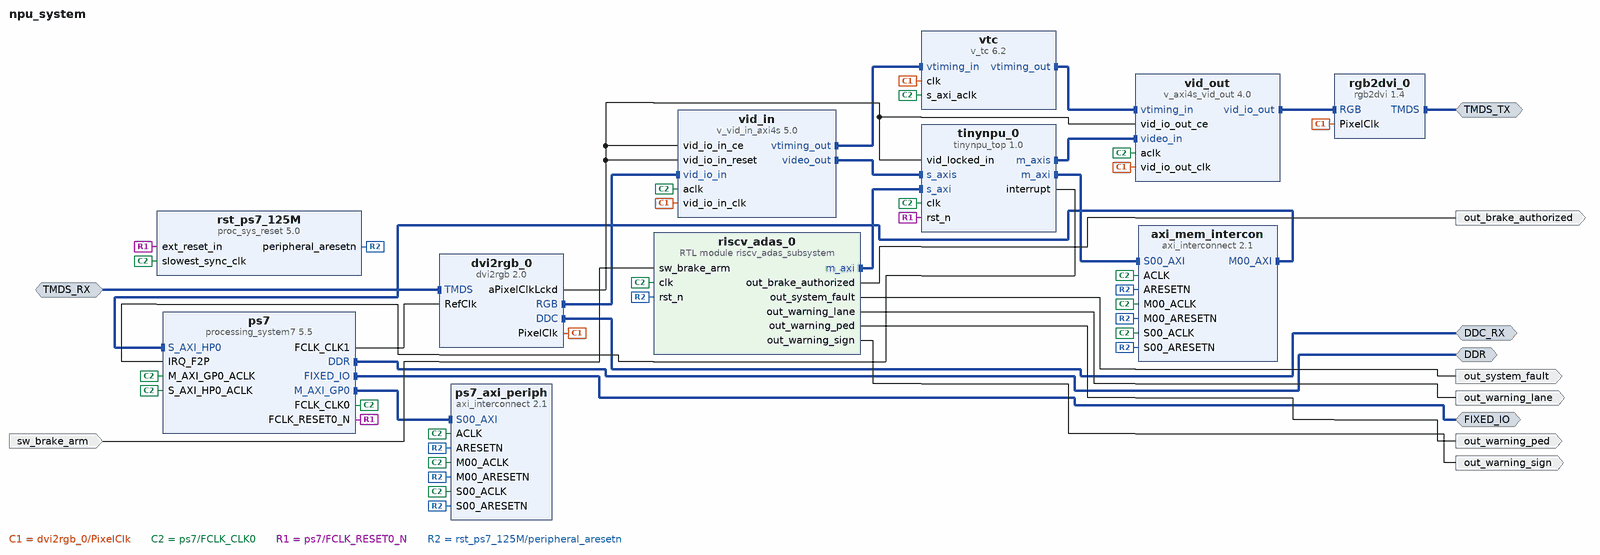
[diagram p0: block diagram of the top level]
# Vivado block design npu_system, xc7z020clg400-1, Vivado 2025.1
create_bd_design npu_system

create_bd_intf_port -mode Master -vlnv xilinx.com:interface:ddrx_rtl:1.0 DDR
create_bd_intf_port -mode Master -vlnv xilinx.com:display_processing_system7:fixedio_rtl:1.0 FIXED_IO
create_bd_intf_port -mode Slave -vlnv digilentinc.com:interface:tmds_rtl:1.0 TMDS_RX
create_bd_intf_port -mode Master -vlnv digilentinc.com:interface:tmds_rtl:1.0 TMDS_TX
create_bd_intf_port -mode Master -vlnv xilinx.com:interface:iic_rtl:1.0 DDC_RX
create_bd_port -dir I sw_brake_arm
create_bd_port -dir O out_warning_ped
create_bd_port -dir O out_warning_lane
create_bd_port -dir O out_warning_sign
create_bd_port -dir O out_brake_authorized
create_bd_port -dir O out_system_fault

create_bd_cell -type ip -vlnv xilinx.com:ip:processing_system7:5.5 ps7
set_property -dict [list \
  CONFIG.PCW_EN_CLK1_PORT 1 \
  CONFIG.PCW_FCLK_CLK1_BUF TRUE \
  CONFIG.PCW_FPGA0_PERIPHERAL_FREQMHZ 125.000000 \
  CONFIG.PCW_FPGA1_PERIPHERAL_FREQMHZ 200 \
  CONFIG.PCW_FPGA_FCLK1_ENABLE 1 \
  CONFIG.PCW_IRQ_F2P_INTR 1 \
  CONFIG.PCW_USE_FABRIC_INTERRUPT 1 \
  CONFIG.PCW_USE_S_AXI_HP0 1 \
] [get_bd_cells ps7]
# 30 more settings of ps7 are not shown: defaults, MIO pin electricals, DDR timing, and values the tool derives
create_bd_cell -type ip -vlnv ai.local:user:tinynpu_top:1.0 tinynpu_0
create_bd_cell -type ip -vlnv digilentinc.com:ip:dvi2rgb:2.0 dvi2rgb_0
set_property -dict {CONFIG.kEmulateDDC true CONFIG.kRstActiveHigh false} [get_bd_cells dvi2rgb_0]
create_bd_cell -type ip -vlnv digilentinc.com:ip:rgb2dvi:1.4 rgb2dvi_0
set_property -dict {CONFIG.kRstActiveHigh false} [get_bd_cells rgb2dvi_0]
create_bd_cell -type ip -vlnv xilinx.com:ip:v_vid_in_axi4s:5.0 vid_in
set_property -dict {CONFIG.C_HAS_ASYNC_CLK 1 CONFIG.C_PIXELS_PER_CLOCK 1} [get_bd_cells vid_in]
create_bd_cell -type ip -vlnv xilinx.com:ip:v_axi4s_vid_out:4.0 vid_out
set_property -dict {CONFIG.C_HAS_ASYNC_CLK 1 CONFIG.C_PIXELS_PER_CLOCK 1} [get_bd_cells vid_out]
create_bd_cell -type ip -vlnv xilinx.com:ip:v_tc:6.2 vtc
set_property -dict {CONFIG.enable_detection true CONFIG.enable_generation true} [get_bd_cells vtc]
create_bd_cell -type ip -vlnv xilinx.com:ip:axi_interconnect:2.1 ps7_axi_periph
set_property -dict {CONFIG.NUM_MI 1} [get_bd_cells ps7_axi_periph]
create_bd_cell -type ip -vlnv xilinx.com:ip:proc_sys_reset:5.0 rst_ps7_125M
create_bd_cell -type ip -vlnv xilinx.com:ip:axi_interconnect:2.1 axi_mem_intercon
set_property -dict {CONFIG.M00_HAS_REGSLICE 4 CONFIG.NUM_MI 1 CONFIG.S00_HAS_REGSLICE 4} [get_bd_cells axi_mem_intercon]
create_bd_cell -type module -reference riscv_adas_subsystem riscv_adas_0

# ---- connections ----

connect_bd_intf_net -intf_net TMDS_0_1 [get_bd_intf_ports TMDS_RX] [get_bd_intf_pins dvi2rgb_0/TMDS]
connect_bd_intf_net [get_bd_intf_pins axi_mem_intercon/M00_AXI] [get_bd_intf_pins ps7/S_AXI_HP0]
connect_bd_intf_net [get_bd_intf_ports DDC_RX] [get_bd_intf_pins dvi2rgb_0/DDC]
connect_bd_intf_net [get_bd_intf_pins dvi2rgb_0/RGB] [get_bd_intf_pins vid_in/vid_io_in]
connect_bd_intf_net [get_bd_intf_ports DDR] [get_bd_intf_pins ps7/DDR]
connect_bd_intf_net [get_bd_intf_ports FIXED_IO] [get_bd_intf_pins ps7/FIXED_IO]
connect_bd_intf_net [get_bd_intf_pins ps7/M_AXI_GP0] [get_bd_intf_pins ps7_axi_periph/S00_AXI]
connect_bd_intf_net [get_bd_intf_ports TMDS_TX] [get_bd_intf_pins rgb2dvi_0/TMDS]
connect_bd_intf_net [get_bd_intf_pins riscv_adas_0/m_axi] [get_bd_intf_pins tinynpu_0/s_axi]
connect_bd_intf_net [get_bd_intf_pins tinynpu_0/m_axi] [get_bd_intf_pins axi_mem_intercon/S00_AXI]
connect_bd_intf_net [get_bd_intf_pins tinynpu_0/m_axis] [get_bd_intf_pins vid_out/video_in]
connect_bd_intf_net [get_bd_intf_pins vid_in/video_out] [get_bd_intf_pins tinynpu_0/s_axis]
connect_bd_intf_net [get_bd_intf_pins vid_in/vtiming_out] [get_bd_intf_pins vtc/vtiming_in]
connect_bd_intf_net [get_bd_intf_pins vid_out/vid_io_out] [get_bd_intf_pins rgb2dvi_0/RGB]
connect_bd_intf_net [get_bd_intf_pins vtc/vtiming_out] [get_bd_intf_pins vid_out/vtiming_in]
connect_bd_net [get_bd_pins dvi2rgb_0/PixelClk] \
  [get_bd_pins vid_in/vid_io_in_clk] [get_bd_pins vid_out/vid_io_out_clk] [get_bd_pins rgb2dvi_0/PixelClk] \
  [get_bd_pins vtc/clk]
connect_bd_net [get_bd_pins dvi2rgb_0/aPixelClkLckd] \
  [get_bd_pins vid_in/vid_io_in_ce] [get_bd_pins vid_in/vid_io_in_reset] [get_bd_pins vid_out/vid_io_out_ce] \
  [get_bd_pins tinynpu_0/vid_locked_in]
connect_bd_net [get_bd_pins ps7/FCLK_CLK0] \
  [get_bd_pins ps7/M_AXI_GP0_ACLK] [get_bd_pins ps7_axi_periph/S00_ACLK] [get_bd_pins rst_ps7_125M/slowest_sync_clk] \
  [get_bd_pins tinynpu_0/clk] [get_bd_pins ps7_axi_periph/M00_ACLK] [get_bd_pins ps7_axi_periph/ACLK] \
  [get_bd_pins axi_mem_intercon/S00_ACLK] [get_bd_pins ps7/S_AXI_HP0_ACLK] [get_bd_pins axi_mem_intercon/M00_ACLK] \
  [get_bd_pins axi_mem_intercon/ACLK] [get_bd_pins vid_in/aclk] [get_bd_pins vid_out/aclk] [get_bd_pins vtc/s_axi_aclk] \
  [get_bd_pins riscv_adas_0/clk]
connect_bd_net [get_bd_pins ps7/FCLK_CLK1] [get_bd_pins dvi2rgb_0/RefClk]
connect_bd_net [get_bd_pins ps7/FCLK_RESET0_N] [get_bd_pins rst_ps7_125M/ext_reset_in] [get_bd_pins tinynpu_0/rst_n]
connect_bd_net [get_bd_pins riscv_adas_0/out_brake_authorized] [get_bd_ports out_brake_authorized]
connect_bd_net [get_bd_pins riscv_adas_0/out_system_fault] [get_bd_ports out_system_fault]
connect_bd_net [get_bd_pins riscv_adas_0/out_warning_lane] [get_bd_ports out_warning_lane]
connect_bd_net [get_bd_pins riscv_adas_0/out_warning_ped] [get_bd_ports out_warning_ped]
connect_bd_net [get_bd_pins riscv_adas_0/out_warning_sign] [get_bd_ports out_warning_sign]
connect_bd_net [get_bd_pins rst_ps7_125M/peripheral_aresetn] \
  [get_bd_pins ps7_axi_periph/S00_ARESETN] [get_bd_pins ps7_axi_periph/M00_ARESETN] [get_bd_pins ps7_axi_periph/ARESETN] \
  [get_bd_pins axi_mem_intercon/S00_ARESETN] [get_bd_pins axi_mem_intercon/M00_ARESETN] \
  [get_bd_pins axi_mem_intercon/ARESETN] [get_bd_pins riscv_adas_0/rst_n]
connect_bd_net -net sw_brake_arm_0_1 [get_bd_ports sw_brake_arm] [get_bd_pins riscv_adas_0/sw_brake_arm]
connect_bd_net [get_bd_pins tinynpu_0/interrupt] [get_bd_pins ps7/IRQ_F2P]

# ---- address map ----
exclude_bd_addr_seg -offset 0x40000000 -range 1G -target_address_space [get_bd_addr_spaces ps7/Data] [get_bd_addr_segs tinynpu_0/s_axi/reg0]
assign_bd_address -offset 0x40000000 -range 64K -target_address_space [get_bd_addr_spaces riscv_adas_0/m_axi] [get_bd_addr_segs tinynpu_0/s_axi/reg0]
assign_bd_address -offset 0x00000000 -range 512M -target_address_space [get_bd_addr_spaces tinynpu_0/m_axi] [get_bd_addr_segs ps7/S_AXI_HP0/HP0_DDR_LOWOCM]

validate_bd_design
save_bd_design
